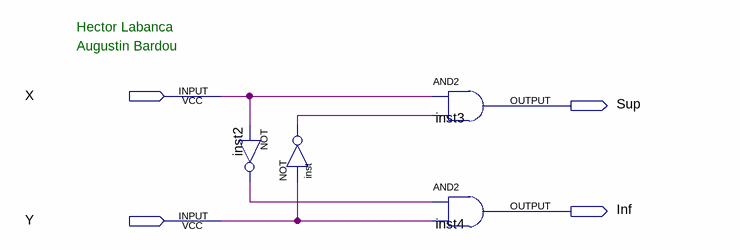
[diagram p0: schematic sheet]
// Quartus schematic COMP1.bdf as structural Verilog: 4 symbols, 4 pins
module COMP1 (
  input  X,
  input  Y,
  output Sup,
  output Inf
);

  wire inst2_out, inst_out;

  not inst2 (inst2_out, X);
  not inst (inst_out, Y);
  and inst3 (Sup, X, inst_out);
  and inst4 (Inf, inst2_out, Y);

  // Notes on the sheet:
  //   Hector Labanca
  //   Augustin Bardou
endmodule
